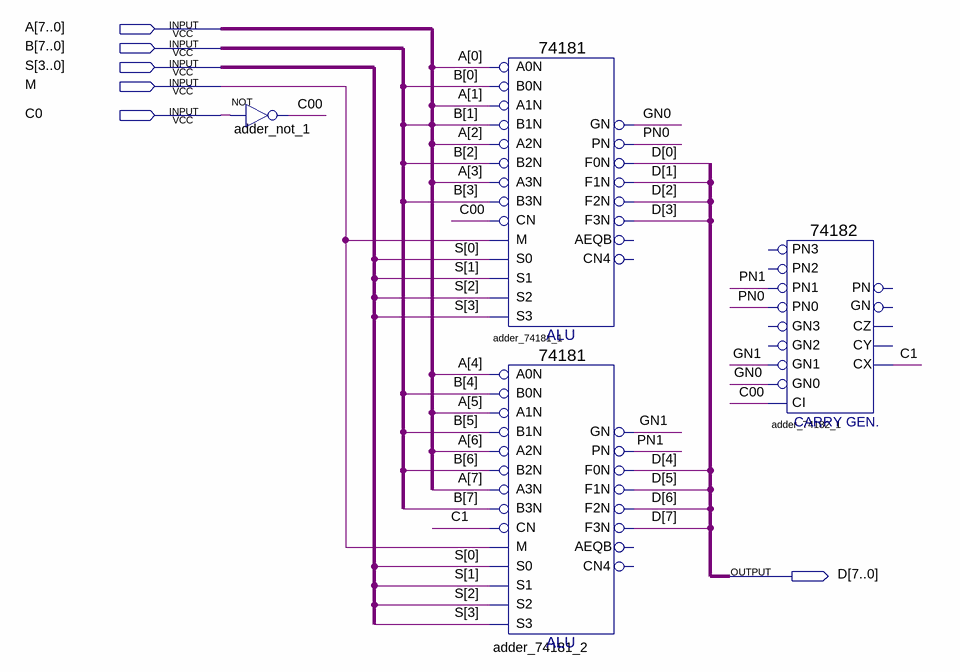
[diagram p0: schematic sheet]
// Quartus schematic adder.bdf as structural Verilog: 4 symbols, 6 pins
module adder (
  input  [7:0] A,
  input  [7:0] B,
  input  [3:0] S,
  input  M,
  input  C0,
  output [7:0] D
);

  wire C00, C1, GN0, GN1, PN0, PN1;

  not adder_not_1 (C00, C0);
  \74181  adder_74181_1 (
    .B0N(B[0]), .A0N(A[0]), .A1N(A[1]), .B1N(B[1]), .A3N(A[3]), .B2N(B[2]), .A2N(A[2]), .M(M), .CN(C00),
    .B3N(B[3]), .S2(S[2]), .S1(S[1]), .S0(S[0]), .S3(S[3]), .PN(PN0), .GN(GN0), .F3N(D[3]), .F1N(D[1]),
    .F0N(D[0]), .F2N(D[2]));  // open: AEQB, CN4
  \74181  adder_74181_2 (
    .B0N(B[4]), .A0N(A[4]), .A1N(A[5]), .B1N(B[5]), .A3N(A[7]), .B2N(B[6]), .A2N(A[6]), .M(M), .CN(C1),
    .B3N(B[7]), .S2(S[2]), .S1(S[1]), .S0(S[0]), .S3(S[3]), .PN(PN1), .GN(GN1), .F3N(D[7]), .F1N(D[5]),
    .F0N(D[4]), .F2N(D[6]));  // open: AEQB, CN4
  \74182  adder_74182_1 (
    .CI(C00), .PN1(PN1), .PN0(PN0), .GN1(GN1), .GN0(GN0), .CX(C1));  // open: PN2, GN2, GN3, PN3, CY, PN, CZ, GN
endmodule
